# EAGLE design electromag_pwm (EAGLE 7.3.0)
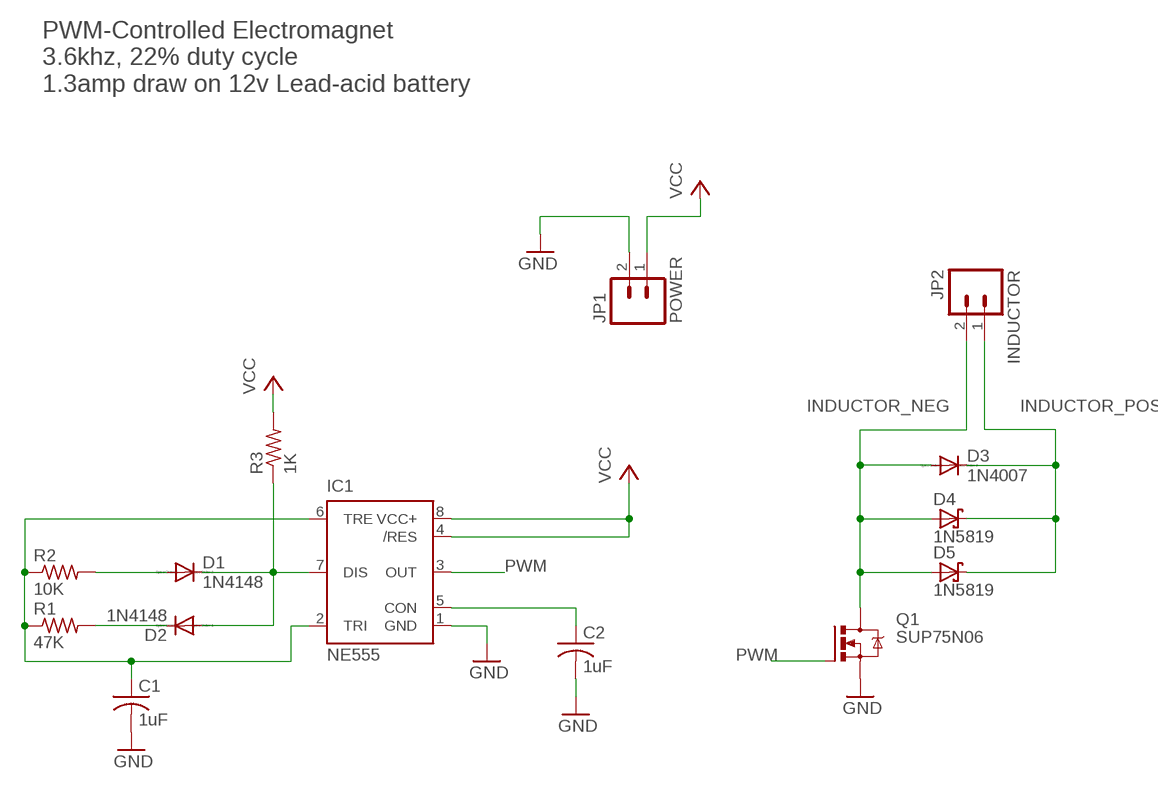
[diagram p0: schematic, sheet 1]

## Parts
C1  1uF  C-US025-025X050  [C025-025X050]
C2  1uF  C-US025-025X050  [C025-025X050]
D1  1N4148  1N4148DO35-7  [DO35-7]
D2  1N4148  1N4148DO35-7  [DO35-7]
D3  1N4007  1N4004  [DO41-10]
D4  1N5819  1N5819-B  [DO41-7.6]
D5  1N5819  1N5819-B  [DO41-7.6]
IC1  NE555  [DIL-08]
JP1  POWER  M02JST-PTH-VERT  [JST-2-PTH-VERT]
JP2  INDUCTOR  M02JST-PTH-VERT  [JST-2-PTH-VERT]
Q1  SUP75N06  IRLZ44Z  [TO220BH]
R1  47K  R-US_0204/5  [0204/5]
R2  10K  R-US_0204/5  [0204/5]
R3  1K  R-US_0204/5  [0204/5]

## Nets
GND: C1.2 C2.2 IC1.1(GND) JP1.2 Q1.S
INDUCTOR_NEG: D3.A D4.A D5.A JP2.2 Q1.D
INDUCTOR_POS: D3.C D4.C D5.C JP2.1
N$2: D2.C R1.2
N$3: D1.A R2.2
N$5: C2.1 IC1.5(CON)
N$6: C1.1 IC1.2(TRI) IC1.6(TRE) R1.1 R2.1
N$7: D1.C D2.A IC1.7(DIS) R3.1
PWM: IC1.3(OUT) Q1.G
VCC: IC1.4(/RES) IC1.8(VCC+) JP1.1 R3.2

## Notes on the sheet
- PWM-Controlled Electromagnet
  3.6khz, 22% duty cycle
  1.3amp draw on 12v Lead-acid battery

## Library data of the parts
C1 C2 = rcl:C-US: CAPACITOR, American symbol
D1 D2 = diode:1N4148: DIODE high speed (Philips)
D3 = diode:1N4004: DIODE general purpose rectifier, 1 A
D4 D5 = diode:1N581*: 1.0A SCHOTTKY BARRIER RECTIFIER Source: http://www.diodes.com/datasheets/ds23001.pdf
IC1 = st-microelectronics:NE555: General purpose bipolar Timer; MF: Arrow Electronics; MPN: NE555N; OC_FARNELL: 1467742; OC_NEWARK: 89K1486
JP1 JP2 = SparkFun-Connectors:M02: Standard 2-pin 0.1" header. Use with - straight break away headers ( PRT-00116) - right angle break away headers (PRT-00553) - swiss pins (PRT-00743) - machine pins (PRT-00117) - female headers (PRT-00115) Molex polarized connector foot print use with: PRT-08233 with associated crimp pins and housings. 2.54_SCREWTERM for use with PRT-10571. 3.5mm Screw Terminal footprints for PRT-08084 5mm Screw Terminal footprints for use with PRT-08432
Q1 = transistor-power:IRLZ44Z: N-Channel HEXFET® Power MOSFET Logic Level AUTOMOTIVE MOSFET Source: http://www.irf.com/product-info/datasheets/data/irlz44zpbf.pdf
R1-R3 = rcl:R-US_: RESISTOR, American symbol

## Board
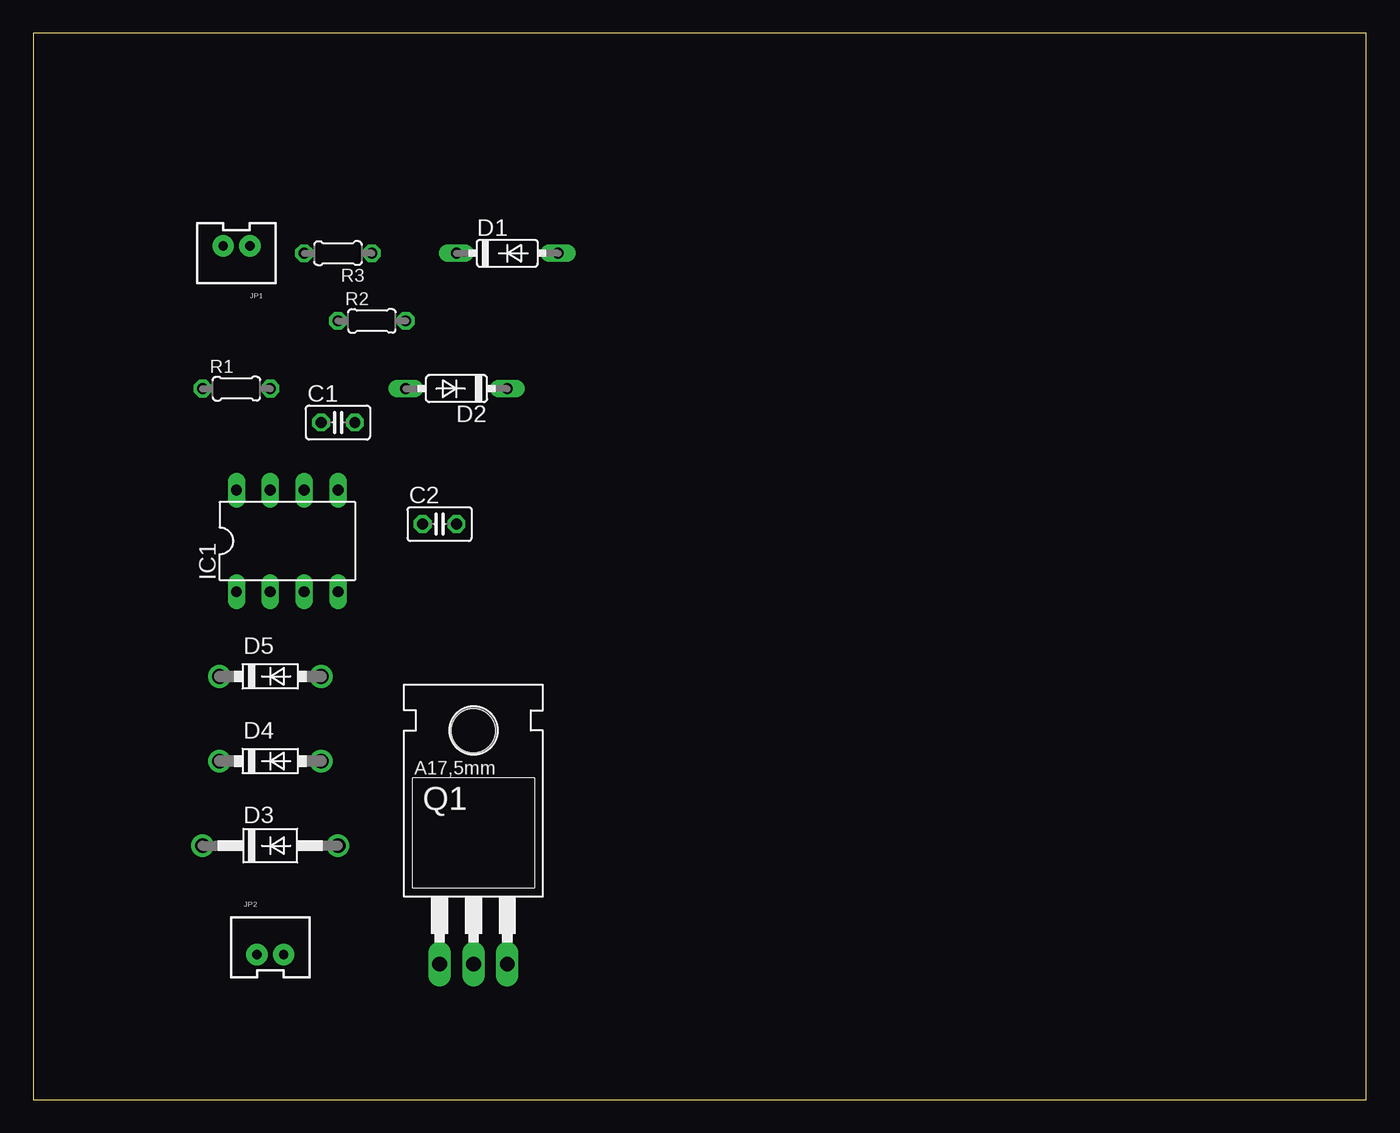
[diagram p1: board, top side]
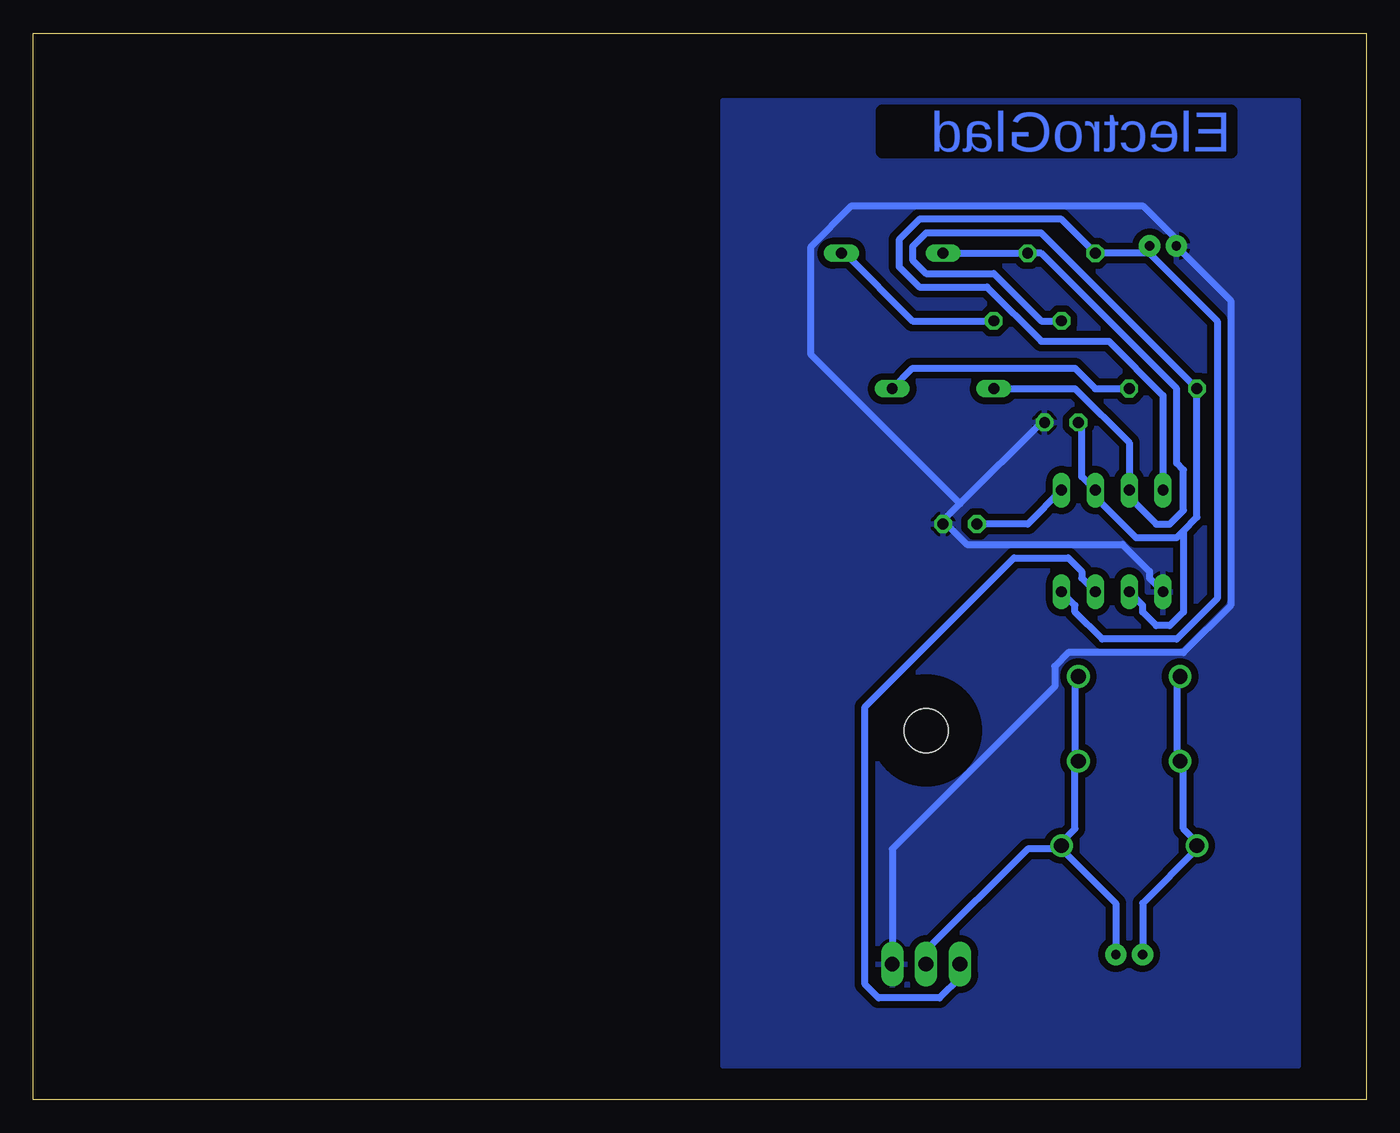
[diagram p2: board, bottom side, seen from below]

Size 100 x 80 mm. Coordinates in mm from the lower left corner, seen from the top.
Outline: 0,0 100,0 100,80 0,80 0,0
Copper layers (1*16): Top 0.035mm / dielectric 1.5mm / Bottom 0.035mm
Design rules "home_etch": minimum track width 20mil, minimum drill 24mil, track to track 20mil, track to pad 20mil, pad to pad 20mil, via to via 20mil, smd to smd 8mil, copper to edge 40mil, drill to drill 8mil, minimum pad ring 10mil, minimum via ring 8mil, stop-mask expansion 4mil, vias tented up to drill 0mil, thermal gap 10mil

### Footprints (pad centres in the part's own frame; a part is rotated, then mirrored left to right if it is on the bottom)
C025-025X050 = drill 0.813 octagon: 1 -1.27,0; 2 1.27,0
DO35-7 = drill 0.813 long: A 3.81,0; C -3.81,0
DO41-10 = drill 1.118: A 5.08,0; C -5.08,0
DO41-7.6 = drill 1.1 pad 1.7: A 3.81,0; C -3.81,0
DIL-08 = drill 0.813 long: 1 -3.81,-3.81; 2 -1.27,-3.81; 3 1.27,-3.81; 4 3.81,-3.81; 5 3.81,3.81; 6 1.27,3.81; 7 -1.27,3.81; 8 -3.81,3.81
JST-2-PTH-VERT = drill 0.7 pad 1.6: 1 -1,-0.55; 2 1,-0.55
TO220BH = drill 1.118 long: D 0,-6.35; G -2.54,-6.35; S 2.54,-6.35 | hole 3.302: 0,11.176
0204/5 = drill 0.813 octagon: 1 -2.54,0; 2 2.54,0

### Placement (x,y rotation side)
C1  22.86,50.8 0 top
C2  30.48,43.18 0 top
D1  35.56,63.5 0 top
D2  31.75,53.34 180 top
D3  17.78,19.05 0 top
D4  17.78,25.4 0 top
D5  17.78,31.75 0 top
IC1  19.05,41.91 0 top
JP1  15.24,63.5 180 top
JP2  17.78,11.43 0 top
Q1  33.02,16.51 0 top
R1  15.24,53.34 0 top
R2  25.4,58.42 0 top
R3  22.86,63.5 180 top

### Tracks (layer width: path | path; a pad name or v marks a point on that pad's centre or on a via)
GND
  Bottom 0.508: IC1.1 16.26,39.12 16.26,39.62 18.29,41.66 29.97,41.66 31.5,43.18 C2.2 32,43.18 30.48,44.7 | 30.48,44.7 24.38,50.8 C1.2 | 30.48,44.7 41.66,55.88 41.66,64.01 38.61,67.06 16.76,67.06 14.22,64.52 JP1.2 14.22,64.01 10.16,59.94 10.16,37.08 13.72,33.53 22.35,33.53 23.37,32.51 23.37,30.99 35.56,18.8 Q1.S
  pour Bottom: 48.26,74.93 48.26,2.54 5.08,2.54 5.08,74.93
INDUCTOR_NEG
  Bottom 0.508: 21.84,25.4 21.84,31.5 D5.A | 22.86,18.8 18.8,14.73 18.8,11.18 JP2.2 | Q1.D 33.02,11.18 25.4,18.8 22.86,18.8 | 22.86,18.8 D3.A 22.86,19.3 21.84,20.32 21.84,25.4 | 21.84,25.4 D4.A
INDUCTOR_POS
  Bottom 0.508: D5.C 14.22,31.5 14.22,25.4 D4.C 13.72,25.4 13.72,20.32 12.7,19.3 D3.C 12.7,18.8 16.76,14.73 16.76,11.18 JP2.1
N$2
  Bottom 0.508: R1.2 20.32,53.34 21.84,54.86 34.04,54.86 D2.C
N$3
  Bottom 0.508: R2.2 34.04,58.42 39.12,63.5 D1.A
N$5
  Bottom 0.508: C2.1 25.4,43.18 IC1.5
N$6
  Bottom 0.508: 13.72,42.67 14.22,42.16 17.27,42.16 20.32,45.21 IC1.6 21.34,46.74 21.34,50.8 C1.1 | 13.72,42.67 12.7,43.69 R1.1 24.38,65.02 33.02,65.02 34.04,64.01 34.04,62.99 33.02,61.98 27.94,61.98 24.38,58.42 R2.1 | IC1.2 16.76,37.08 16.76,36.58 15.75,35.56 14.73,35.56 13.72,36.58 13.72,42.67
N$7
  Bottom 0.508: D1.C R3.1 24.38,63.5 14.22,53.34 14.22,47.75 13.72,47.24 13.72,44.2 14.73,43.18 15.75,43.18 17.78,45.21 IC1.7 17.78,49.28 21.84,53.34 D2.A
PWM
  Bottom 0.508: IC1.3 21.34,39.12 21.34,39.62 22.35,40.64 26.42,40.64 37.59,29.46 37.59,8.64 36.58,7.62 32,7.62 30.48,9.14 Q1.G
VCC
  Bottom 0.508: IC1.8 15.24,52.83 19.3,56.9 24.38,56.9 28.45,60.96 33.53,60.96 35.05,62.48 35.05,64.52 33.53,66.04 22.86,66.04 R3.2 16.26,63.5 | IC1.4 21.84,37.08 21.84,36.58 19.81,34.54 14.22,34.54 11.18,37.59 11.18,58.42 16.26,63.5 | 16.26,63.5 16.26,64.01 JP1.1 16.26,63.5

### Text on the board
Bottom: ElectroGlad